# Altium schematic sheet MainBoard_PERIPH.SchDoc
size 594 x 420 mm; DocumentNumber: VSL.23-MOTHERBOARD; SheetNumber: 5; Format: A2
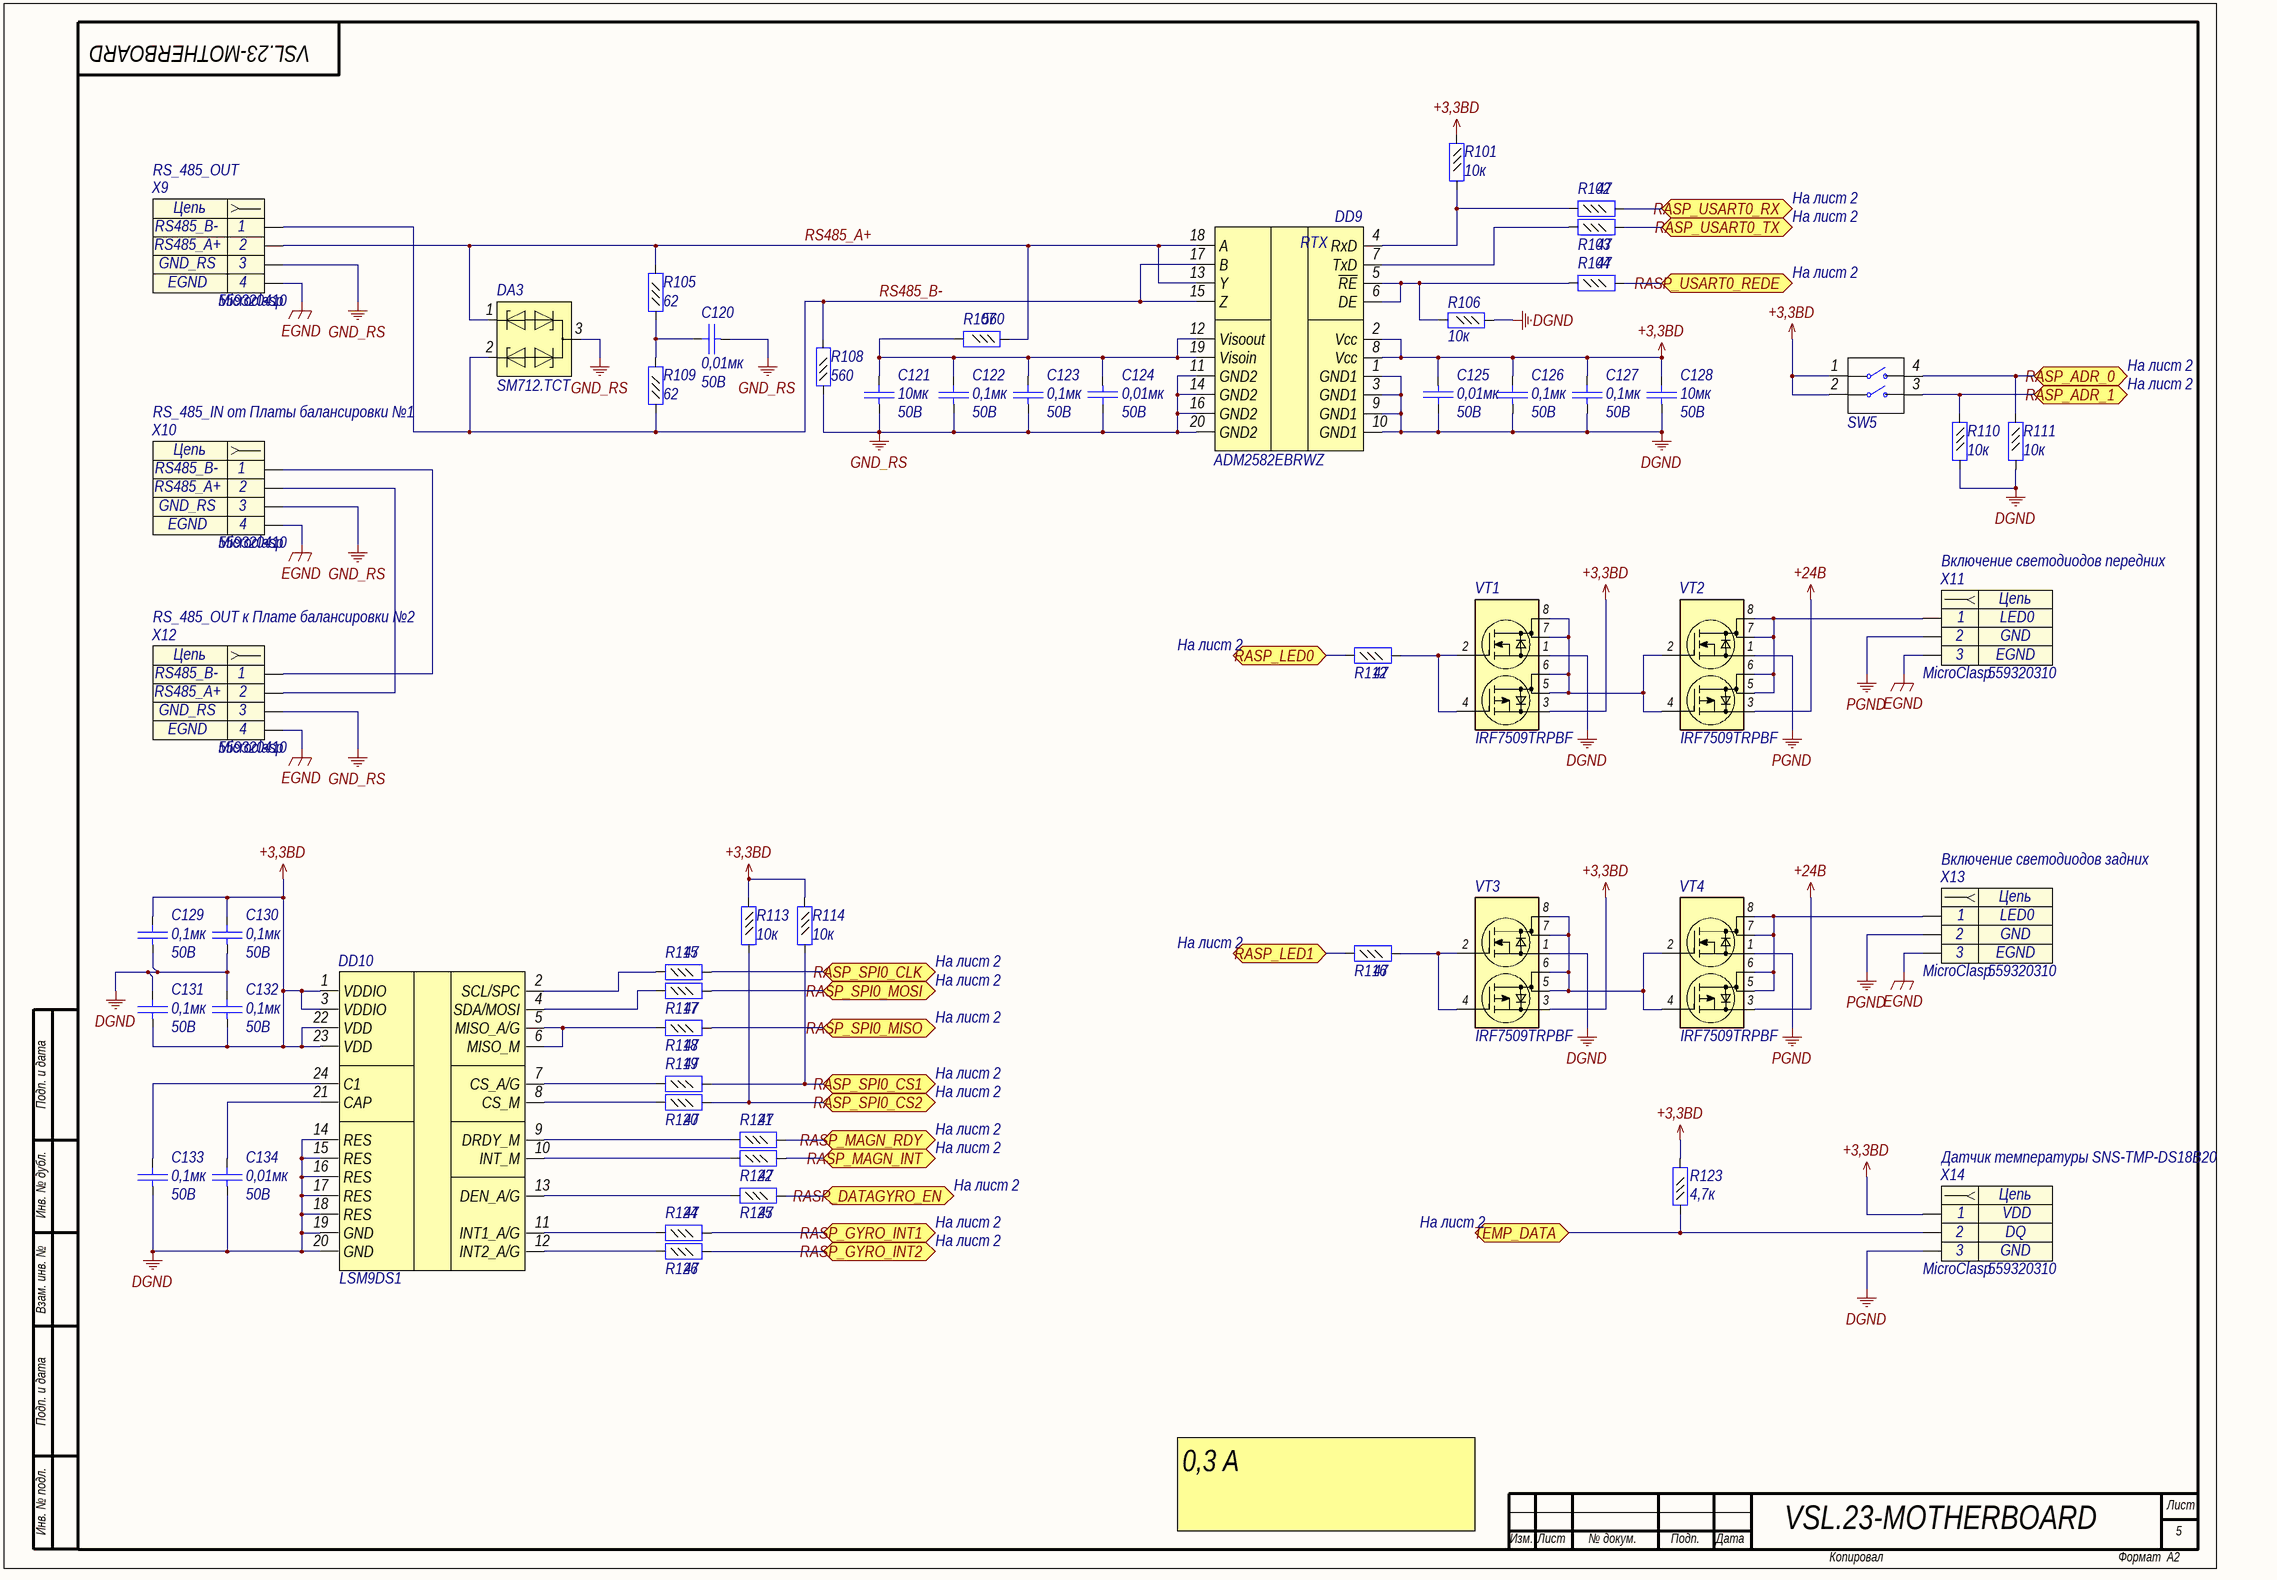
[diagram p0: MainBoard_PERIPH.SchDoc]

## Parts
C120  value 0,01мк  Voltage: 50B  [C0402]  (hidden comment: Capacitor)
C121  Voltage: 50В  [C1210]  (hidden comment: 10мк)
C122  value 0,1мк  Voltage: 50В  [C0402]  (hidden comment: Capacitor)
C123  value 0,1мк  Voltage: 50В  [C0402]  (hidden comment: Capacitor)
C124  Voltage: 50B  [C0402]  (hidden comment: 0,01мк)
C125  Voltage: 50B  [C0402]  (hidden comment: 0,01мк)
C126  value 0,1мк  Voltage: 50В  [C0402]  (hidden comment: Capacitor)
C127  value 0,1мк  Voltage: 50В  [C0402]  (hidden comment: Capacitor)
C128  Voltage: 50В  [C1210]  (hidden comment: 10мк)
C129  value 0,1мк  Voltage: 50В  [C0402]  (hidden comment: Capacitor)
C130  value 0,1мк  Voltage: 50В  [C0402]  (hidden comment: Capacitor)
C131  value 0,1мк  Voltage: 50В  [C0402]  (hidden comment: Capacitor)
C132  value 0,1мк  Voltage: 50В  [C0402]  (hidden comment: Capacitor)
C133  value 0,1мк  Voltage: 50В  [C0402]  (hidden comment: Capacitor)
C134  Voltage: 50B  [C0402]  (hidden comment: 0,01мк)
DA3  Part Number: SM712.TCT  [SOT23-3]  (hidden comment: SM712)
DD9  Part Number: ADM2582EBRWZ  [SO20W]
DD10  LSM9DS1  [LGA24]
R101  value 10к  [R0402]  (hidden comment: Resistor_0,062Вт)
R102  value 47  [R0402]  (hidden comment: Resistor_0,062Вт)
R103  value 47  [R0402]  (hidden comment: Resistor_0,062Вт)
R104  value 47  [R0402]  (hidden comment: Resistor_0,062Вт)
R105  value 62  [R0402]  (hidden comment: Resistor_0,062Вт)
R106  value 10к  [R0402]  (hidden comment: Resistor_0,062Вт)
R107  value 560  [R0402]  (hidden comment: Resistor_0,062Вт)
R108  value 560  [R0402]  (hidden comment: Resistor_0,062Вт)
R109  value 62  [R0402]  (hidden comment: Resistor_0,062Вт)
R110  value 10к  [R0402]  (hidden comment: Resistor_0,062Вт)
R111  value 10к  [R0402]  (hidden comment: Resistor_0,062Вт)
R112  value 47  [R0402]  (hidden comment: Resistor_0,062Вт)
R113  value 10к  [R0402]  (hidden comment: Resistor_0,062Вт)
R114  value 10к  [R0402]  (hidden comment: Resistor_0,062Вт)
R115  value 47  [R0402]  (hidden comment: Resistor_0,062Вт)
R116  value 47  [R0402]  (hidden comment: Resistor_0,062Вт)
R117  value 47  [R0402]  (hidden comment: Resistor_0,062Вт)
R118  value 47  [R0402]  (hidden comment: Resistor_0,062Вт)
R119  value 47  [R0402]  (hidden comment: Resistor_0,062Вт)
R120  value 47  [R0402]  (hidden comment: Resistor_0,062Вт)
R121  value 47  [R0402]  (hidden comment: Resistor_0,062Вт)
R122  value 47  [R0402]  (hidden comment: Resistor_0,062Вт)
R123  value 4,7к  [R0402]  (hidden comment: Resistor_0,062Вт)
R124  value 47  [R0402]  (hidden comment: Resistor_0,062Вт)
R125  value 47  [R0402]  (hidden comment: Resistor_0,062Вт)
R126  value 47  [R0402]  (hidden comment: Resistor_0,062Вт)
SW5  DS1040-02  [2PAD_ADR]  (value not drawn)
VT1  IRF7509TRPBF  [Micro8]
VT2  IRF7509TRPBF  [Micro8]
VT3  IRF7509TRPBF  [Micro8]
VT4  IRF7509TRPBF  [Micro8]
X9  RS_485_OUT  Part Number: 559320410  [MOLEX_559320410]
X10  RS_485_IN от Платы балансировки №1  Part Number: 559320410  [MOLEX_559320410]
X11  Включение светодиодов передних  Part Name: MicroClasp  Part Number: 559320310  [MOLEX_559320310]
X12  RS_485_OUT к Плате балансировки №2  Part Number: 559320410  [MOLEX_559320410]
X13  Включение светодиодов задних  Part Name: MicroClasp  Part Number: 559320310  [MOLEX_559320310]
X14  Датчик температуры SNS-TMP-DS18B20  Part Name: MicroClasp  Part Number: 559320310  [MOLEX_559320310]

## Ports
RASP_ADR_0, RASP_ADR_1, RASP_DATAGYRO_EN, RASP_GYRO_INT1, RASP_GYRO_INT2, RASP_LED0, RASP_LED1, RASP_MAGN_INT, RASP_MAGN_RDY, RASP_SPI0_CLK, RASP_SPI0_CS1, RASP_SPI0_CS2, RASP_SPI0_MISO, RASP_SPI0_MOSI, RASP_USART0_REDE, RASP_USART0_RX, RASP_USART0_TX, TEMP_DATA

## Nets
+3,3BD: C125.1 C126.2 C127.2 C128.2 C129.2 C130.2 C131.1 C132.1 DD9.2(Vcc) DD9.8(Vcc) DD10.1(VDDIO) DD10.3(VDDIO) DD10.22(VDD) DD10.23(VDD) R101.1 R113.1 R114.1 R123.2 SW5.1 SW5.2 VT1.3(S2) VT3.3(S2) X14.1
+24B: VT2.3(S2) VT4.3(S2)
DGND: C125.2 C126.1 C127.1 C128.1 C129.1 C130.1 C131.2 C132.2 C133.1 C134.1 DD9.1(GND1) DD9.3(GND1) DD9.9(GND1) DD9.10(GND1) DD10.14(RES) DD10.15(RES) DD10.16(RES) DD10.17(RES) DD10.18(RES) DD10.19(GND) DD10.20(GND) R106.1 R110.2 R111.2 VT1.1(S1) VT3.1(S1) X14.3
EGND: X9.4 X10.4 X11.3 X12.4 X13.3
GND_RS: C120.1 C121.1 C122.1 C123.1 C124.2 DA3.3 DD9.11(GND2) DD9.14(GND2) DD9.16(GND2) DD9.20(GND2) R108.1 X9.3 X10.3 X12.3
PGND: VT2.1(S1) VT4.1(S1) X11.2 X13.2
RASP_ADR_0: R111.1 SW5.4 ; port RASP_ADR_0
RASP_ADR_1: R110.1 SW5.3 ; port RASP_ADR_1
RASP_DATAGYRO_EN: R125.2 ; port RASP_DATAGYRO_EN
RASP_GYRO_INT1: R124.2 ; port RASP_GYRO_INT1
RASP_GYRO_INT2: R126.2 ; port RASP_GYRO_INT2
RASP_LED0: R112.1 ; port RASP_LED0
RASP_LED1: R116.1 ; port RASP_LED1
RASP_MAGN_INT: R122.2 ; port RASP_MAGN_INT
RASP_MAGN_RDY: R121.2 ; port RASP_MAGN_RDY
RASP_SPI0_CLK: R115.2 ; port RASP_SPI0_CLK
RASP_SPI0_CS1: R114.2 R119.2 ; port RASP_SPI0_CS1
RASP_SPI0_CS2: R113.2 R120.2 ; port RASP_SPI0_CS2
RASP_SPI0_MISO: R118.2 ; port RASP_SPI0_MISO
RASP_SPI0_MOSI: R117.2 ; port RASP_SPI0_MOSI
RASP_USART0_REDE: R104.2 ; port RASP_USART0_REDE
RASP_USART0_RX: R102.2 ; port RASP_USART0_RX
RASP_USART0_TX: R103.2 ; port RASP_USART0_TX
RS485_A+: DA3.1 DD9.13(Y) DD9.18(A) R105.2 R107.1 X9.2
RS485_B-: DA3.2 DD9.15(Z) DD9.17(B) R108.2 R109.1 X9.1
TEMP_DATA: R123.1 X14.2 ; port TEMP_DATA
NetC120_2: C120.2 R105.1 R109.2
NetC121_2: C121.2 C122.2 C123.2 C124.1 DD9.12(Visoout) DD9.19(Visoin) R107.2
NetC133_2: C133.2 DD10.24(C1)
NetC134_2: C134.2 DD10.21(CAP)
NetDD9_4: DD9.4(RxD) R101.2 R102.1
NetDD9_5: DD9.5(~{RE}) DD9.6(DE) R104.1 R106.2
NetDD9_7: DD9.7(TxD) R103.1
NetDD10_2: DD10.2(SCL/SPC) R115.1
NetDD10_4: DD10.4(SDA/MOSI) R117.1
NetDD10_5: DD10.5(MISO_A/G) DD10.6(MISO_M) R118.1
NetDD10_7: DD10.7(CS_A/G) R119.1
NetDD10_8: DD10.8(CS_M) R120.1
NetDD10_9: DD10.9(DRDY_M) R121.1
NetDD10_10: DD10.10(INT_M) R122.1
NetDD10_11: DD10.11(INT1_A/G) R124.1
NetDD10_12: DD10.12(INT2_A/G) R126.1
NetDD10_13: DD10.13(DEN_A/G) R125.1
NetR112_2: R112.2 VT1.2(G1) VT1.4(G2)
NetR116_2: R116.2 VT3.2(G1) VT3.4(G2)
NetVT1_5: VT1.5(D2) VT1.6(D2) VT1.7(D1) VT1.8(D1) VT2.2(G1) VT2.4(G2)
NetVT2_5: VT2.5(D2) VT2.6(D2) VT2.7(D1) VT2.8(D1) X11.1
NetVT3_5: VT3.5(D2) VT3.6(D2) VT3.7(D1) VT3.8(D1) VT4.2(G1) VT4.4(G2)
NetVT4_5: VT4.5(D2) VT4.6(D2) VT4.7(D1) VT4.8(D1) X13.1
NetX10_1: X10.1 X12.1
NetX10_2: X10.2 X12.2

## Notes on the sheet
- На лист 2
- Microclasp
- Подп. и дата
- Инв. № дубл.
- Взам. инв. №
- Инв. № подл.
- 0,3 А
- Лист
- Изм.
- № докум.
- Подп.
- Дата
- Копировал
- Формат
- (in symbol connect96) Цепь
- (in symbol connect97) Цепь
- (in symbol interf21) RTX

## Library data of the parts
C120 C124 C125 C134 = cap42: Конденсатор; Part Name: Ceramic; Manufacture: Murata; Part Number: GRM155R71H103K; id: cap42; TKE: X7R
  C124 C125 C134: Value: 0,01мк
C121 C128 = cap297: Конденсатор; Part Name: MLCC; Manufacture: TDK; Part Number: C3225X7R1H106K250AC; id: cap297; TKE: X7R; tga: 0,10%; Value: 10мк
C122 C123 C126 C127 C129-C133 = cap277: Конденсатор; Part Name: Ceramic; Manufacture: Murata; Part Number: GRM155R71H104KE14D; id: cap277; TKE: X7R; tga: 0,10%
DA3 = SM712.TCT: TVS; Part Name: TVS DiodeCommon-Mode RS-485; Manufacture: Semtech; id: esd6; Max Reverse Voltage: 12B; Breakdown Voltage: 13,3B; Leakage current: 20uA; Capacitance: 75pF; Number of Channels: 2
DD9 = interf21: Приемопередатчик RS485 изолированный; Part Name: Signal and Power Isolated RS-485; Manufacture: Analog Devices; Speed: 16Mbps; Type Supply: Single Polar; id: interf21
DD10 = LSM9DS1: 3D accelerometer, 3D gyroscope, 3D magnetometer; Manufacture: ST Microelectronics; id: sensor6; Type sensor: Accelerometer,gyroscope,magnetometer; Interface: I2C,SPI; Part Number: LSM9DS1; Part Name: 3D accelerometer, 3D gyroscope, 3D magnetometer
R101 R106 R110 R111 R113 R114 = res294: Резистор; Manufacture: Yageo; Part Number: RC0402FR-0710KL; id: res294; Accuracy: 0,01; Part Name: Resistor; Power: 0,062Вт
R102-R104 R112 R115-R122 R124-R126 = res238: Резистор; Manufacture: Yageo; Part Number: RC0402FR-0747RL; id: res238; Accuracy: 0,01; Part Name: Resistor; Power: 0,062Вт
R105 R109 = res241: Резистор; Manufacture: Yageo; Part Number: RC0402FR-0762RL; id: res241; Accuracy: 0,01; Part Name: Resistor; Power: 0,062Вт
R107 R108 = res264: Резистор; Manufacture: Yageo; Part Number: RC0402FR-07560RL; id: res264; Accuracy: 0,01; Part Name: Resistor; Power: 0,062Вт
R123 = res286: Резистор; Manufacture: Yageo; Part Number: RC0402FR-074K7; id: res286; Accuracy: 0,01; Part Name: Resistor; Power: 0,062Вт
SW5 = btn8: DIP переключатель; Part Name: Перемычка адреса; id: btn8
VT1-VT4 = mosfert3: Комплементарная сборка МОП; Manufacturer: International Rectifier; Structure: n-p-channel; V drain-source max: 30B; Rds: 0,11Ohm; Gate-to-source voltage: (+-)20B; Continuous drain current: 2A; Pulsed drain current: 16A; Power dissipation: 1,25W; id: mosfert3; Part Number: IRF7509TRPBF
X9 X10 X12 = connect97: Разъем - 4 конт. розетка; Part Name: MicroClasp Wire-to-Board Header; Manufacture: Molex; Contact_1: RS485_B-; Contact_2: RS485_A+; Contact_3: GND_RS; Contact_4: EGND; Etch: 2mm; id: connect97
X11 X13 = connect96: Разъем - 3 конт. розетка; Manufacture: Molex; Contact_1: LED0; Contact_2: GND; Contact_3: EGND; Etch: 2mm; id: connect96
X14 = connect96: Разъем - 3 конт. розетка; Manufacture: Molex; Contact_1: VDD; Contact_2: DQ; Contact_3: GND; Etch: 2mm; id: connect96